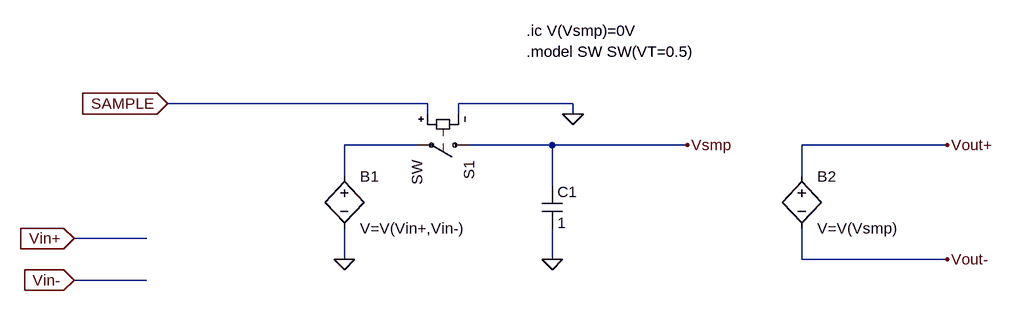
[diagram p0: schematic decoder.test.asc]
decoder.test.asc, the LTspice schematic file:
Version 4
SHEET 1 1560 680
WIRE 144 128 -256 128
WIRE 368 128 192 128
WIRE 144 144 144 128
WIRE 192 144 192 128
WIRE 368 144 368 128
WIRE 128 192 16 192
WIRE 336 192 208 192
WIRE 544 192 336 192
WIRE 944 192 720 192
WIRE 16 240 16 192
WIRE 720 240 720 192
WIRE 336 256 336 192
WIRE -288 336 -400 336
WIRE 16 368 16 320
WIRE 336 368 336 320
WIRE 720 368 720 320
WIRE 944 368 720 368
WIRE -288 400 -400 400
FLAG 368 144 0
FLAG -256 128 SAMPLE
IOPIN -256 128 In
FLAG -400 336 Vin+
IOPIN -400 336 In
FLAG 544 192 Vsmp
FLAG 16 368 0
FLAG 336 368 0
FLAG 944 192 Vout+
FLAG -400 400 Vin-
IOPIN -400 400 In
FLAG 944 368 Vout-
SYMBOL bv 16 224 R0
SYMATTR InstName B1
SYMATTR Value V=V(Vin+,Vin-)
SYMBOL sw 224 192 R90
SYMATTR InstName S1
SYMBOL cap 320 256 R0
SYMATTR InstName C1
SYMATTR Value 1
SYMBOL bv 720 224 R0
SYMATTR InstName B2
SYMATTR Value V=V(Vsmp)
TEXT 296 16 Left 2 !.ic V(Vsmp)=0V
TEXT 296 48 Left 2 !.model SW SW(VT=0.5)

The netlist it stands for:
* decoder.test.asc
B1 N001 0 V=V(Vin+,Vin-)
S1 Vsmp N001 SAMPLE 0 SW
C1 Vsmp 0 1
B2 Vout+ Vout- V=V(Vsmp)
.ic V(Vsmp)=0V
.model SW SW(VT=0.5)
.backanno
.end